# Altium schematic sheet GNSS_MB.SchDoc
size A3; SheetNumber: 1; SheetTotal: 1
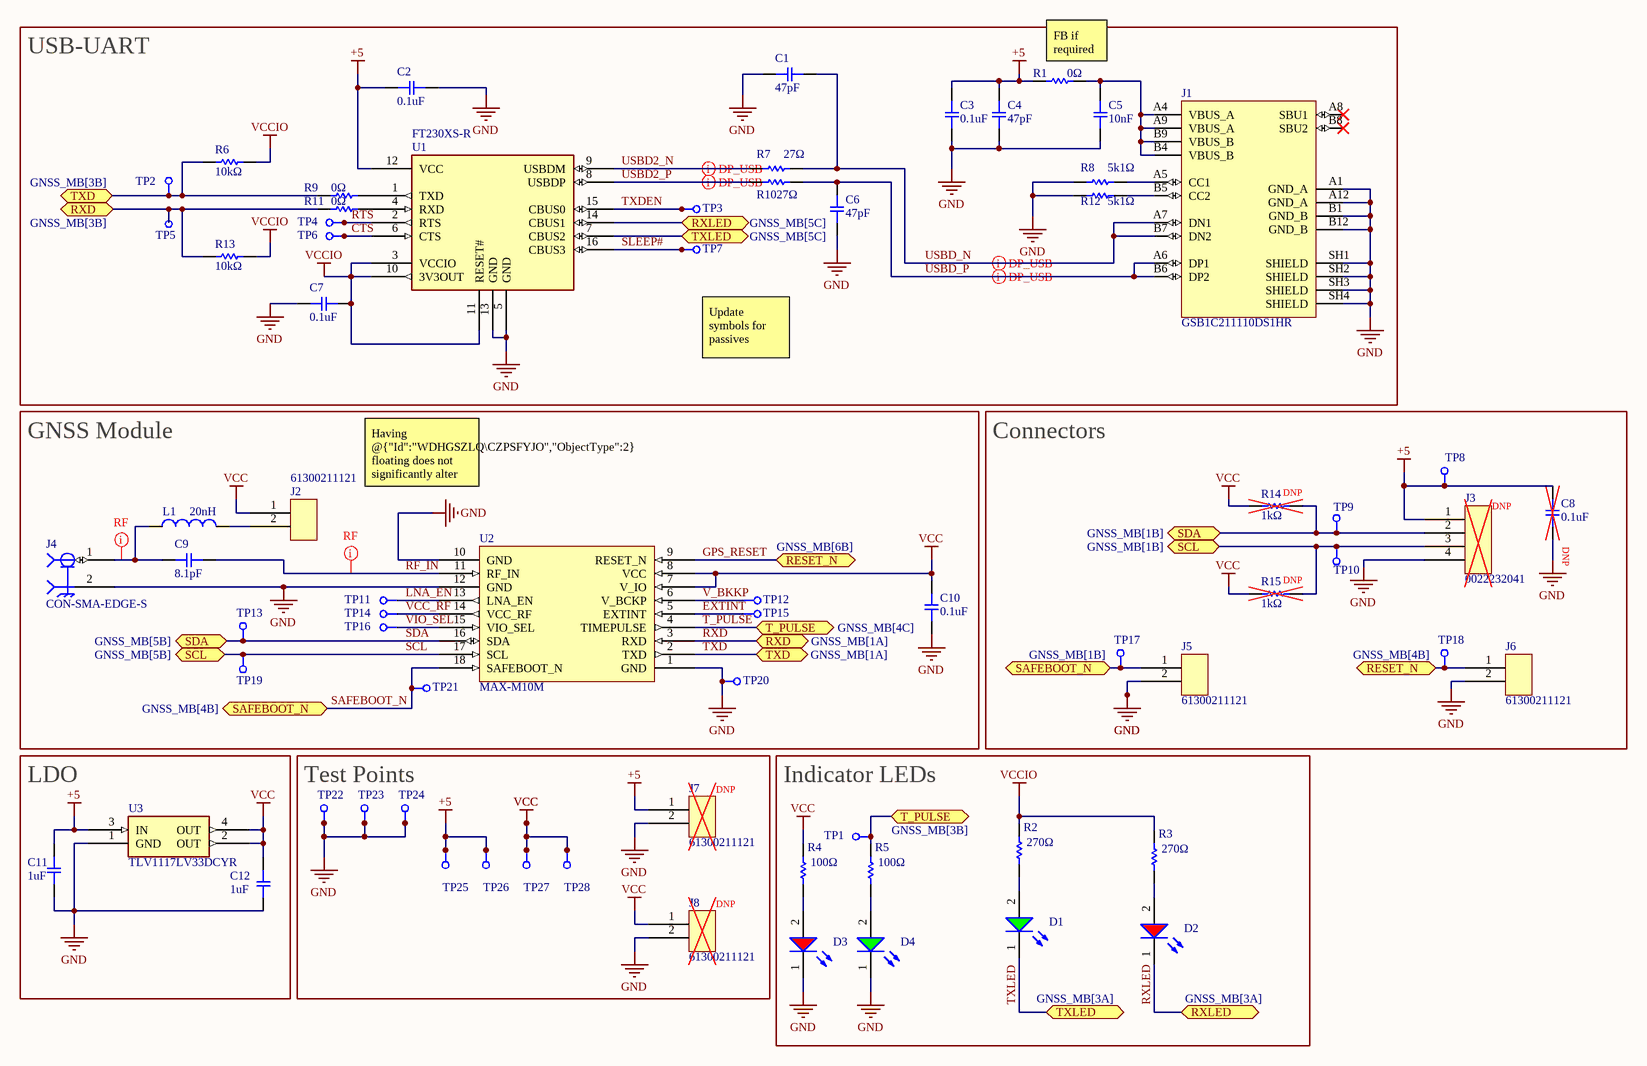
[diagram p0: GNSS_MB.SchDoc]

## Parts
C1  Capacitance: 47pF  [CAP_MURATA_0603]  (hidden comment: GCM188L81H104KA57D)
C2  Capacitance: 0.1uF  [CAP_MURATA_0603]  (hidden comment: GCM188L81H104KA57D)
C3  Capacitance: 0.1uF  [CAP_MURATA_0603]  (hidden comment: GCM188L81H104KA57D)
C4  Capacitance: 47pF  [CAP_MURATA_0603]  (hidden comment: GCM188L81H104KA57D)
C5  Capacitance: 10nF  [CAP_MURATA_0603]  (hidden comment: GCM188L81H104KA57D)
C6  Capacitance: 47pF  [CAP_MURATA_0603]  (hidden comment: GCM188L81H104KA57D)
C7  Capacitance: 0.1uF  [CAP_MURATA_0603]  (hidden comment: GCM188L81H104KA57D)
C8  Capacitance: 0.1uF  [CAP_MURATA_0603]  (hidden comment: GCM188L81H104KA57D)
C9  Capacitance: 8.1pF  [CAP_MURATA_0603]  (hidden comment: GCM188L81H104KA57D)
C10  Capacitance: 0.1uF  [CAP_MURATA_0603]  (hidden comment: GCM188L81H104KA57D)
C11  Capacitance: 1uF  [CAP_MURATA_0603]  (hidden comment: GRM188R61A105KA61D)
C12  Capacitance: 1uF  [CAP_MURATA_0603]  (hidden comment: GRM188R61A105KA61D)
D1  Green, 3.2V, 140°  [WL-SMCW - duplicate]  (value not drawn)
D2  Red, 2V, 140°  [WL-SMCW - duplicate]  (value not drawn)
D3  Red, 2V, 140°  [WL-SMCW - duplicate]  (value not drawn)
D4  Green, 3.2V, 140°  [WL-SMCW - duplicate]  (value not drawn)
J1  GSB1C211110DS1HR  [AMPHENOL_GSB1C211110DS1HR]
J2  61300211121  [61300211121]
J3  0022232041  [CONN HEADER VERT 4POS 2.54MM]
J4  CON-SMA-EDGE-S  [RFSOLUTIONS_CON-SMA-EDGE-S]
J5  61300211121  [61300211121]
J6  61300211121  [61300211121]
J7  61300211121  [61300211121]
J8  61300211121  [61300211121]
L1  value 20nH  [INDC1006X60N]  (hidden comment: LQW15AN3N6C10D)
R1  Resistance: 0Ω  [RC0603JR-070RL]  (hidden comment: RC0603JR-070RL)
R2  Resistance: 270Ω  [RC0603JR-070RL]  (hidden comment: RC0603JR-070RL)
R3  Resistance: 270Ω  [RC0603JR-070RL]  (hidden comment: RC0603JR-070RL)
R4  Resistance: 100Ω  [RC0603JR-070RL]  (hidden comment: RC0603JR-070RL)
R5  Resistance: 100Ω  [RC0603JR-070RL]  (hidden comment: RC0603JR-070RL)
R6  Resistance: 10kΩ  [RC0603JR-070RL]  (hidden comment: RC0603JR-070RL)
R7  Resistance: 27Ω  [RC0603JR-070RL]  (hidden comment: RC0603JR-070RL)
R8  Resistance: 5k1Ω  [RC0603JR-070RL]  (hidden comment: RC0603JR-070RL)
R9  Resistance: 0Ω  [RC0603JR-070RL]  (hidden comment: RC0603JR-070RL)
R10  Resistance: 27Ω  [RC0603JR-070RL]  (hidden comment: RC0603JR-070RL)
R11  Resistance: 0Ω  [RC0603JR-070RL]  (hidden comment: RC0603JR-070RL)
R12  Resistance: 5k1Ω  [RC0603JR-070RL]  (hidden comment: RC0603JR-070RL)
R13  Resistance: 10kΩ  [RC0603JR-070RL]  (hidden comment: RC0603JR-070RL)
R14  Resistance: 1kΩ  [RC0603JR-070RL]  (hidden comment: RC0603JR-070RL)
R15  Resistance: 1kΩ  [RC0603JR-070RL]  (hidden comment: RC0603JR-070RL)
TP1  TEST_POINT  [TEST_POINT]  (value not drawn)
TP2  TEST_POINT  [TEST_POINT]  (value not drawn)
TP3  TEST_POINT  [TEST_POINT]  (value not drawn)
TP4  TEST_POINT  [TEST_POINT]  (value not drawn)
TP5  TEST_POINT  [TEST_POINT]  (value not drawn)
TP6  TEST_POINT  [TEST_POINT]  (value not drawn)
TP7  TEST_POINT  [TEST_POINT]  (value not drawn)
TP8  TEST_POINT  [TEST_POINT]  (value not drawn)
TP9  TEST_POINT  [TEST_POINT]  (value not drawn)
TP10  TEST_POINT  [TEST_POINT]  (value not drawn)
TP11  TEST_POINT  [TEST_POINT]  (value not drawn)
TP12  TEST_POINT  [TEST_POINT]  (value not drawn)
TP13  TEST_POINT  [TEST_POINT]  (value not drawn)
TP14  TEST_POINT  [TEST_POINT]  (value not drawn)
TP15  TEST_POINT  [TEST_POINT]  (value not drawn)
TP16  TEST_POINT  [TEST_POINT]  (value not drawn)
TP17  TEST_POINT  [TEST_POINT]  (value not drawn)
TP18  TEST_POINT  [TEST_POINT]  (value not drawn)
TP19  TEST_POINT  [TEST_POINT]  (value not drawn)
TP20  TEST_POINT  [TEST_POINT]  (value not drawn)
TP21  TEST_POINT  [TEST_POINT]  (value not drawn)
TP22  TEST_POINT  [TEST_POINT]  (value not drawn)
TP23  TEST_POINT  [TEST_POINT]  (value not drawn)
TP24  TEST_POINT  [TEST_POINT]  (value not drawn)
TP25  TEST_POINT  [TEST_POINT]  (value not drawn)
TP26  TEST_POINT  [TEST_POINT]  (value not drawn)
TP27  TEST_POINT  [TEST_POINT]  (value not drawn)
TP28  TEST_POINT  [TEST_POINT]  (value not drawn)
U1  FT230XS-R  [FT230XS-R]
U2  MAX-M10M  [MAX-M10M]
U3  TLV1117LV33DCYR  [TLV1117LV33DCYR]

## Blocks framed on the sheet
USB-UART: C1-C7 J1 R1 R6-R13 TP2-TP7 U1
GNSS Module: C9 C10 J2 J4 L1 TP11-TP16 TP19-TP21 U2
Connectors: C8 J3 J5 J6 R14 R15 TP8-TP10 TP17 TP18
LDO: C11 C12 U3
Test Points: J7 J8 TP22-TP28
Indicator LEDs: D1-D4 R2-R5 TP1

## Ports
RESET_N (bidir, see GNSS_MB[4B]), RESET_N (bidir, see GNSS_MB[6B]), RXD (bidir, see GNSS_MB[1A]), RXD (bidir, see GNSS_MB[3B]), RXLED (bidir, see GNSS_MB[3A]), RXLED (bidir, see GNSS_MB[5C]), SAFEBOOT_N (bidir, see GNSS_MB[1B]), SAFEBOOT_N (bidir, see GNSS_MB[4B]), SCL (bidir, see GNSS_MB[1B]), SCL (bidir, see GNSS_MB[5B]), SDA (bidir, see GNSS_MB[1B]), SDA (bidir, see GNSS_MB[5B]), T_PULSE (bidir, see GNSS_MB[3B]), T_PULSE (bidir, see GNSS_MB[4C]), TXD (bidir, see GNSS_MB[1A]), TXD (bidir, see GNSS_MB[3B]), TXLED (bidir, see GNSS_MB[3A]), TXLED (bidir, see GNSS_MB[5C])

## Nets
+5: C2.2 C3.1 C4.1 C8.1 C11.2 J3.1 J7.1 R1.1 TP8.1 TP25.1 TP26.1 U1.12(VCC) U3.3(IN)
GND: C1.1 C2.1 C3.2 C4.2 C5.2 C6.2 C7.2 C8.2 C10.1 C11.1 C12.1 D3.1(K) D4.1(K) J1.A1(GND_A) J1.A12(GND_A) J1.B1(GND_B) J1.B12(GND_B) J1.SH1(SHIELD) J1.SH2(SHIELD) J1.SH3(SHIELD) J1.SH4(SHIELD) J3.4 J4.2(GND) J5.2 J6.2 J7.2 J8.2 R8.1 R12.1 TP20.1 TP22.1 TP23.1 TP24.1 U1.5(GND) U1.13(GND) U2.1(GND) U2.10(GND) U2.12(GND) U3.1(GND)
VCC: C10.2 C12.2 J2.1 J8.1 R4.2 R14.2 R15.2 TP27.1 TP28.1 U2.7(V_IO) U2.8(VCC) U3.2(OUT) U3.4(OUT)
VCCIO: C7.1 R2.2 R3.2 R6.2 R13.2 U1.3(VCCIO) U1.10(3V3OUT) U1.11(RESET#)
CTS: TP6.1 U1.6(CTS)
EXTINT: TP15.1 U2.5(EXTINT)
GPS_RESET: J6.1 TP18.1 U2.9(RESET_N) ; port RESET_N
LNA_EN: TP11.1 U2.13(LNA_EN)
RF_IN: C9.2 U2.11(RF_IN)
RTS: TP4.1 U1.2(RTS)
RXD: R11.1 R13.1 TP5.1 U2.3(RXD) ; port RXD
RXLED: D2.1(K) U1.14(CBUS1) ; port RXLED
SAFEBOOT_N: J5.1 TP17.1 TP21.1 U2.18(SAFEBOOT_N) ; port SAFEBOOT_N
SCL: J3.3 R15.1 TP10.1 TP19.1 U2.17(SCL) ; port SCL
SDA: J3.2 R14.1 TP9.1 TP13.1 U2.16(SDA) ; port SDA
SLEEP#: TP7.1 U1.16(CBUS3)
T_PULSE: R5.2 TP1.1 U2.4(TIMEPULSE) ; port T_PULSE
TXD: R6.1 R9.1 TP2.1 U2.2(TXD) ; port TXD
TXDEN: TP3.1 U1.15(CBUS0)
TXLED: D1.1(K) U1.7(CBUS2) ; port TXLED
USBD2_N: R7.1 U1.9(USBDM)
USBD2_P: R10.1 U1.8(USBDP)
USBD_N: C1.2 J1.A7(DN1) J1.B7(DN2) R7.2
USBD_P: C6.1 J1.A6(DP1) J1.B6(DP2) R10.2
V_BKKP: TP12.1 U2.6(V_BCKP)
VCC_RF: TP14.1 U2.14(VCC_RF)
VIO_SEL: TP16.1 U2.15(VIO_SEL)
NetC5_1: C5.1 J1.A4(VBUS_A) J1.A9(VBUS_A) J1.B4(VBUS_B) J1.B9(VBUS_B) R1.2
NetC9_1: C9.1 J4.1(RF) L1.1
NetD1_2: D1.2(A) R2.1
NetD2_2: D2.2(A) R3.1
NetD3_2: D3.2(A) R4.1
NetD4_2: D4.2(A) R5.1
NetJ1_A5: J1.A5(CC1) R8.2
NetJ1_B5: J1.B5(CC2) R12.2
NetJ2_2: J2.2 L1.2
NetR9_2: R9.2 U1.1(TXD)
NetR11_2: R11.2 U1.4(RXD)

Not connected (* = marked no-connect by the designer): J1 A8(SBU1)* B8(SBU2)*

## Layout directives
differential pair; differential pair class USB: USBD2_N, USBD2_P, USBD_N, USBD_P
net class RF: NetC9_1, RF_IN

## Notes on the sheet
- (near R1) FB if required
- (near TP7) Update symbols for passives
- Having @{"Id":"WDHGSZLQ\CZPSFYJO","ObjectType":2} floating does not significantly alter matching
- (near R14) DNP
- (near J3) DNP
- (near C8) DNP
- (near R15) DNP
- (near J7) DNP
- (near J8) DNP

## Library data of the parts
C1-C10 = GCM188L81H104KA57D: CAP CER 0.1UF 50V X8L 0603
C11 C12 = GRM188R61A105KA61D: CAP CER 1UF 10V X5R 0603
D1 D4 = 150060GS75000: WL-SMCW Mono-color Chip LED Waterclear, SMT, size 0603, Green, 3.2V, 140°; Manufacturer: Wurth Elektronik; Case/Size Code: 0603; Chip Technology: InGaN; Dominant Wavelength: 525nm; Luminous Intensity: 430mcd; Peak Wavelength: 515nm; Manufacturer Part Number: 150060GS75000; Category: Signal LEDs; Match Code: WL-SMCW; ComponentLink1Description: Website Link; ComponentLink1URL: https://www.we-online.com/redexpert/article/150060GS75000?ad; ComponentLink2Description: Datasheet Link; ComponentLink2URL: https://www.we-online.com/redexpert/spec/150060GS75000?ad; Mount: Surface Mount; Operating Temperature Max: 85°C; Operating Temperature Min: -40°C; Packaging: Tape and Reel; Length: 1.6mm; Width: 0.8mm; Height: 0.7mm; Emitting Color: Green; Forward Voltage: 3.2V; Viewing Angle: 140°
D2 D3 = 150060RS75000: WL-SMCW Mono-color Chip LED Waterclear, SMT, size 0603, Red, 2V, 140°; Manufacturer: Wurth Elektronik; Case/Size Code: 0603; Chip Technology: AlInGaP; Dominant Wavelength: 625nm; Luminous Intensity: 250mcd; Peak Wavelength: 630nm; Manufacturer Part Number: 150060RS75000; Category: Signal LEDs; Match Code: WL-SMCW; ComponentLink1Description: Website Link; ComponentLink1URL: https://www.we-online.com/redexpert/article/150060RS75000?ad; ComponentLink2Description: Datasheet Link; ComponentLink2URL: https://www.we-online.com/redexpert/spec/150060RS75000?ad; Mount: Surface Mount; Operating Temperature Max: 85°C; Operating Temperature Min: -40°C; Packaging: Tape and Reel; Length: 1.6mm; Width: 0.8mm; Height: 0.7mm; Emitting Color: Red; Forward Voltage: 2V; Viewing Angle: 140°
J1 = GSB1C211110DS1HR: USB2.0, Type C, Top mount, Center Height 1.78mm, Dual Row DIP; MF: Amphenol Canada; SnapEDA_Link: https://www.snapeda.com/parts/GSB1C211110DS1HR/Amphenol/view-part/?ref=snap; Package: None; Value: *; MP: GSB1C211110DS1HR; Check_prices: https://www.snapeda.com/parts/GSB1C211110DS1HR/Amphenol/view-part/?ref=eda
J2 J5-J8 = 61300211121: CONN HEADER VERT 2POS 2.54MM
J3 = 0022232041: CONN HEADER VERT 4POS 2.54MM
J4 = CON-SMA-EDGE-S: CONN SMA JACK STR EDGE MNT
L1 = LQW15AN3N6C10D: FIXED IND 3.6NH 900MA 40 MOHM; Package: None; Price: None; MP: LQW15AN3N6C10D; Availability: Unavailable
R1-R15 = RC0603JR-070RL: Chip Resistor, 0 Ohm, +/- 5%, 0.1 W, -55 to 155 degC, 0603 (1608 Metric), RoHS, Tape and Reel; Manufacturer: Yageo; Temperature Coefficient: 200ppm/degreesC; Voltage Rating: 50V; Power Rating: 100mW; Width: 0.8mm; Max Operating Temperature: 155degC; Tolerance: 5%; Package Reference: 0603; Height: 0.45mm; Depth: 0.8mm; Package Description: 2-Pin Surface Mount Device, Body 1.6 x 0.8 mm; Termination: SMD/SMT; Package Quantity: 5000; Case/Package: 0603; Case Code (Imperial): 0603; Radiation Hardening: No; Number of Pins: 2; Length: 1.6mm; Lead Free: LeadFree; Voltage Rating (DC): 50V; Military Standard: Not; Datasheet URL: http://www.yageo.com/NewPortal/yageodocoutput?fileName=/pdf/R-Chip/PYu-RC_Group_51_RoHS_L_5.pdf; Manufacturer URL: http://www.yageo.com/; Packaging: TapeandReel; Case Code (Metric): 1608; Min Operating Temperature: -55degC; Composition: ThickFilm; RoHSCompliant: true; Contact Plating: Tin; Datasheet Version: Rev. 5, 10/2016; REACH SVHC: NoSVHC
TP1-TP28 = TEST_POINT: TEST POINT 2MM
U1 = FT230XS-R: USB FULL SPEED TO SERIAL UART IC
U2 = MAX-M10M: GNSS LCC RX MOD, ROM, CRYSTAL
U3 = TLV1117LV33DCYR: IC REG LINEAR 3.3V 1A SOT223-4